# EAGLE design SSK_2014_V11 (EAGLE 5.12)
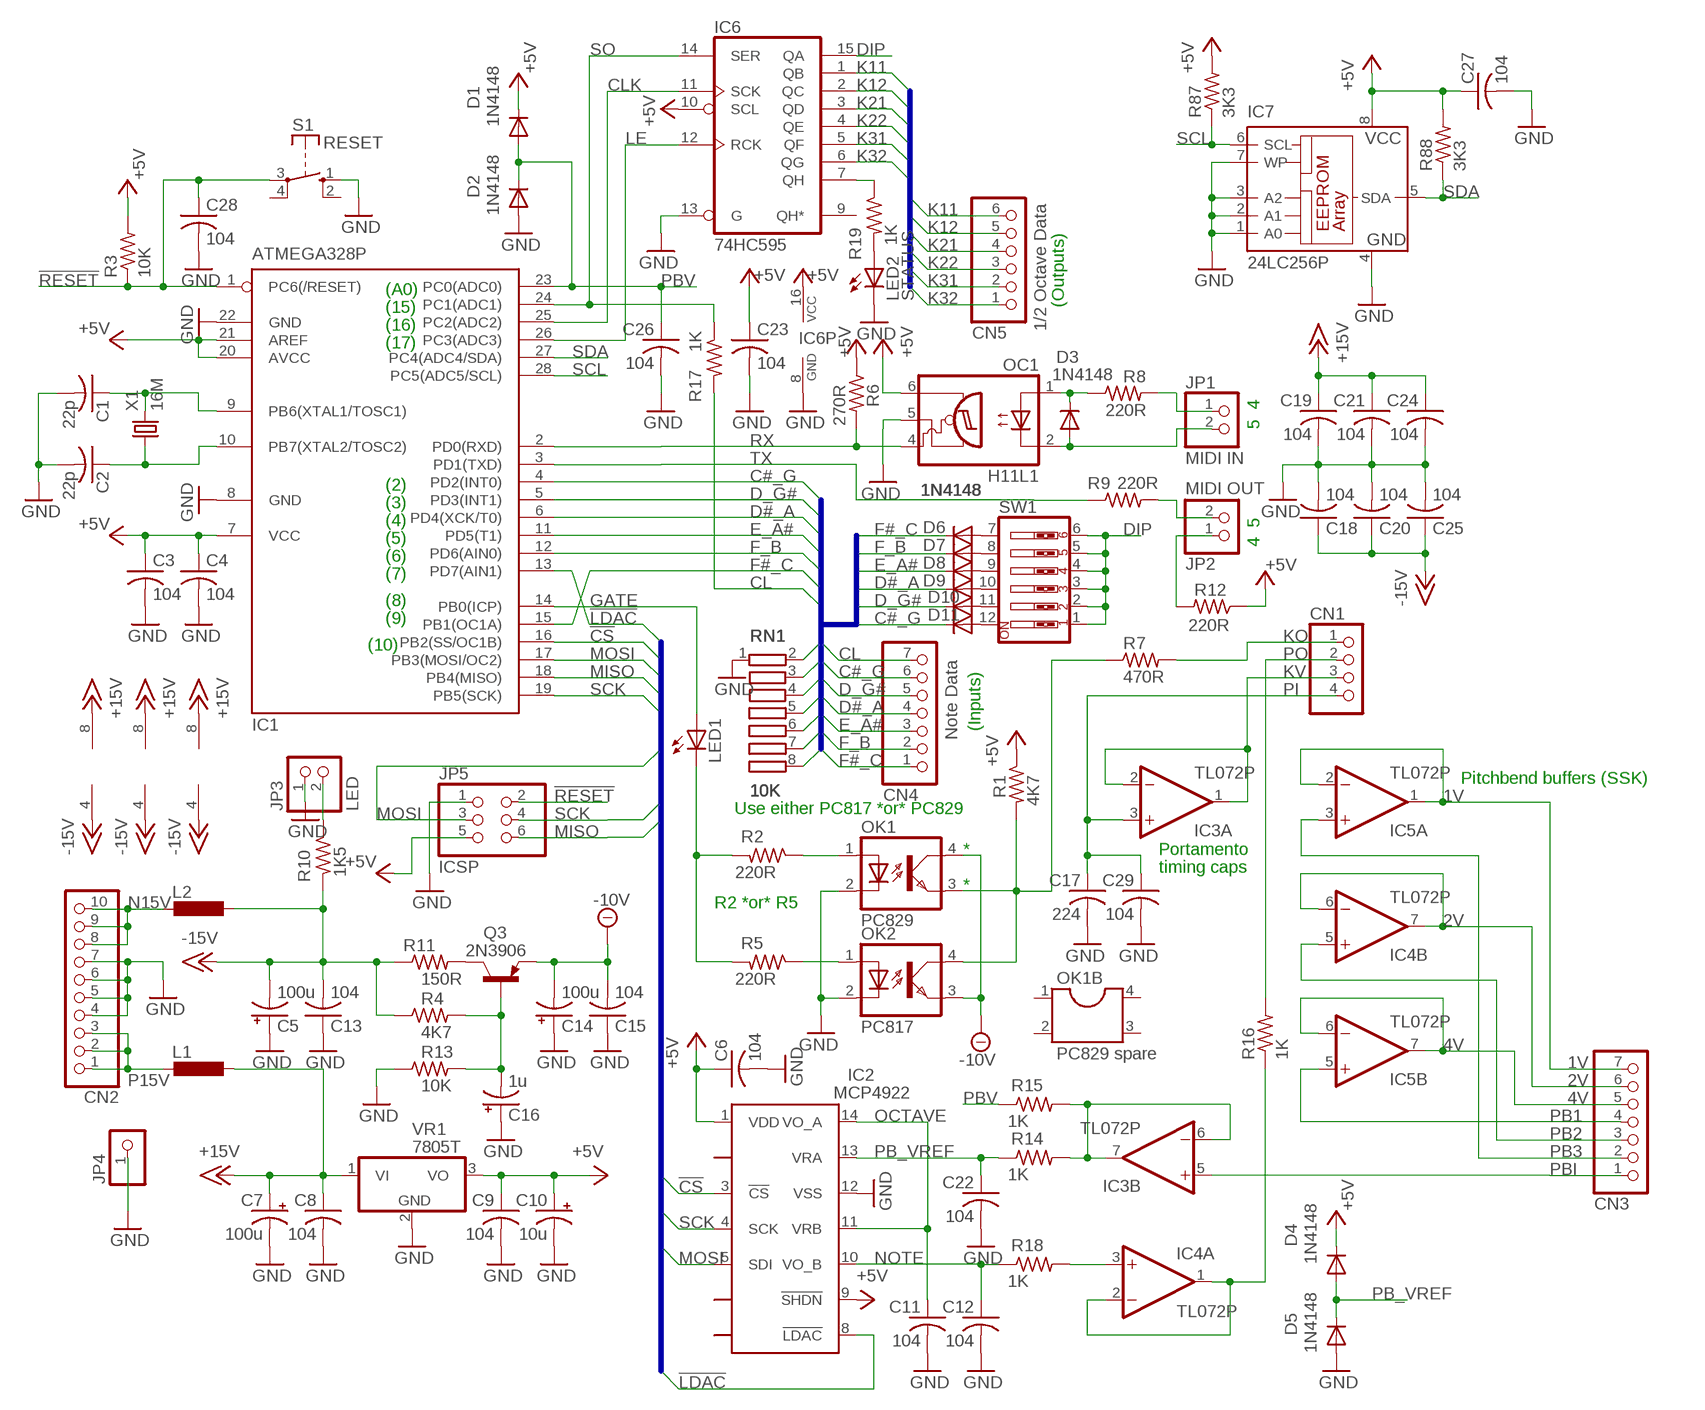
[diagram p0: schematic, sheet 1]

## Parts
C1  22p  C-USC0805K  [C0805K]
C2  22p  C-USC0805K  [C0805K]
C3  104  C-USC0805K  [C0805K]
C4  104  C-USC0805K  [C0805K]
C5  100u  CPOL-USE2.5-7  [E2,5-7]
C6  104  C-USC0805K  [C0805K]
C7  100u  CPOL-USE2.5-7  [E2,5-7]
C8  104  C-USC0805K  [C0805K]
C9  104  C-USC0805K  [C0805K]
C10  10u  CPOL-USE2.5-7  [E2,5-7]
C11  104  C-USC0805K  [C0805K]
C12  104  C-USC0805K  [C0805K]
C13  104  C-USC0805K  [C0805K]
C14  100u  CPOL-USE2.5-7  [E2,5-7]
C15  104  C-USC0805K  [C0805K]
C16  1u  CPOL-USE2.5-7  [E2,5-7]
C17  224  C-US050-030X075  [C050-030X075]
C18  104  C-USC0805K  [C0805K]
C19  104  C-USC0805K  [C0805K]
C20  104  C-USC0805K  [C0805K]
C21  104  C-USC0805K  [C0805K]
C22  104  C-USC0805K  [C0805K]
C23  104  C-USC0805K  [C0805K]
C24  104  C-USC0805K  [C0805K]
C25  104  C-USC0805K  [C0805K]
C26  104  C-USC0805K  [C0805K]
C27  104  C-USC0805K  [C0805K]
C28  104  C-USC0805K  [C0805K]
C29  104  C-US050-030X075  [C050-030X075]
CN1  PINHD-1X4  [1X04]
CN2  PINHD-1X10  [1X10]
CN3  PINHD-1X7  [1X07]
CN4  Note Data  PINHD-1X7  [1X07]
CN5  1/2 Octave Data  PINHD-1X6  [1X06]
D1  1N4148  DIODE-D-5  [D-5]
D2  1N4148  DIODE-D-5  [D-5]
D3  1N4148  1N4148DO35-7  [DO35-7]
D4  1N4148  DIODE-D-5  [D-5]
D5  1N4148  DIODE-D-5  [D-5]
D6  1N4148  DIODE-D-5  [D-5]
D7  1N4148  DIODE-D-5  [D-5]
D8  1N4148  DIODE-D-5  [D-5]
D9  1N4148  DIODE-D-5  [D-5]
D10  1N4148  DIODE-D-5  [D-5]
D11  1N4148  DIODE-D-5  [D-5]
IC1  ATMEGA328P  MEGA8-PN  [DIL28-3N]
IC2  MCP4922  MCP4922N  [DIL14N]
IC3  TL072P  [DIL08]
IC4  TL072P  [DIL08]
IC5  TL072P  [DIL08]
IC6  74HC595  [DIL16N]
IC7  24LC256P  [DIL8]
JP1  MIDI IN  PINHD-1X2  [1X02]
JP2  MIDI OUT  PINHD-1X2  [1X02]
JP3  LED  PINHD-1X2  [1X02]
JP4  PINHD-1X1  [1X01]
JP5  ICSP  PINHD-2X3  [2X03]
L1  L-EU0207/10  [0207/10]
L2  L-EU0207/10  [0207/10]
LED1  LED3MM  [LED3MM]
LED2  STATUS  LED3MM  [LED3MM]
OC1  H11L1  H11L1-M  [DIL06]
OK1  PC829  PC817  [DIL04]
OK1B  PC829 spare  DIL4  [DIL04]
OK2  PC817  [DIL04]
Q3  2N3906  [TO92]
R1  4K7  R-US_0207/10  [0207/10]
R2  220R  R-US_0207/10  [0207/10]
R3  10K  R-US_0207/10  [0207/10]
R4  4K7  R-US_0207/10  [0207/10]
R5  220R  R-US_0207/10  [0207/10]
R6  270R  R-US_0207/10  [0207/10]
R7  470R  R-US_0207/10  [0207/10]
R8  220R  R-US_0207/10  [0207/10]
R9  220R  R-US_0207/10  [0207/10]
R10  1K5  R-US_0207/10  [0207/10]
R11  150R  R-US_0207/10  [0207/10]
R12  220R  R-US_0207/10  [0207/10]
R13  10K  R-US_0207/10  [0207/10]
R14  1K  R-US_0207/10  [0207/10]
R15  1K  R-US_0207/10  [0207/10]
R16  1K  R-US_0207/10  [0207/10]
R17  1K  R-US_0207/10  [0207/10]
R18  1K  R-US_0207/10  [0207/10]
R19  1K  R-US_0207/10  [0207/10]
R87  3K3  R-US_0207/10  [0207/10]
R88  3K3  R-US_0207/10  [0207/10]
RN1  10K  GE07RP  [SIL8]
S1  RESET  RACON12  [RACON12]
SW1  SW_DIP-6  [EDG-06]
VR1  7805T  [TO220H]
X1  16M  CRYSTALHC49S  [HC49/S]

## Nets
1V: CN3.7 IC5.1(A:OUT) IC5.2(A:-IN)
2V: CN3.6 IC4.6(B:-IN) IC4.7(B:OUT)
4V: CN3.5 IC5.6(B:-IN) IC5.7(B:OUT)
!CS!: IC1.16(PB2(SS/OC1B)) IC2.3(!CS)
!LDAC!: IC1.13(PD7(AIN1)) IC2.8(!LDAC)
!RESET: C28.1 IC1.1(PC6(/RESET)) JP5.2 R3.1 S1.3(P)
+5V: C3.1 C4.1 C6.1 C9.1 C10.+ C23.1 C27.1 D1.C D4.C IC1.7(VCC) IC1.20(AVCC) IC1.21(AREF) IC2.1(VDD) IC2.9(!SHDN!) IC6.10(SCL) IC6.16(VCC) IC7.8(VCC) JP5.5 OC1.6(VCC) R1.1 R3.2 R6.1 R12.1 R87.2 R88.2 VR1.3(VO)
+15V: C7.+ C8.1 C19.1 C21.1 C24.1 IC3.8(P:V+) IC4.8(P:V+) IC5.8(P:V+) L1.1 VR1.1(VI)
-10V: C14.- C15.2 OK1.4(COL) OK2.3(EMIT) Q3.3(E)
-15V: C5.- C13.2 C18.1 C20.1 C25.1 IC3.4(P:V-) IC4.4(P:V-) IC5.4(P:V-) L2.1 R4.1 R10.2 R11.1
C#_G: CN4.6 D11.C IC1.4(PD2(INT0)) RN1.3
CL: CN4.7 R17.2 RN1.2
CLK: IC1.25(PC2(ADC2)) IC6.11(SCK)
D#_A: CN4.4 D9.C IC1.6(PD4(XCK/T0)) RN1.5
D_G#: CN4.5 D10.C IC1.5(PD3(INT1)) RN1.4
DBG: IC6.7(QH) R19.1
DIP: IC6.15(QA) SW1.1 SW1.2 SW1.3 SW1.4 SW1.5 SW1.6
E_A#: CN4.3 D8.C IC1.11(PD5(T1)) RN1.6
F#_C: CN4.1 D6.C IC1.15(PB1(OC1A)) RN1.8
F_B: CN4.2 D7.C IC1.12(PD6(AIN0)) RN1.7
GATE: IC1.14(PB0(ICP)) LED1.A
GND: C1.2 C2.2 C3.2 C4.2 C5.+ C6.2 C7.- C8.2 C9.2 C10.- C11.2 C12.2 C13.1 C14.+ C15.1 C16.+ C17.2 C18.2 C19.2 C20.2 C21.2 C22.2 C23.2 C24.2 C25.2 C26.2 C27.2 C28.2 C29.2 CN2.4 CN2.5 CN2.6 CN2.7 D2.A D5.A IC1.8(GND) IC1.22(GND) IC2.12(VSS) IC6.8(GND) IC6.13(G) IC7.1(A0) IC7.2(A1) IC7.3(A2) IC7.4(GND) IC7.7(WP) JP3.1 JP4.1 JP5.1 LED2.K(C) OC1.5(GND) OK1.2(C) OK2.2(C) R13.1 RN1.1 S1.1(S) VR1.2(GND)
K11: CN5.6 IC6.1(QB)
K12: CN5.5 IC6.2(QC)
K21: CN5.4 IC6.3(QD)
K22: CN5.3 IC6.4(QE)
K31: CN5.2 IC6.5(QF)
K32: CN5.1 IC6.6(QG)
KO: CN1.1 R7.2
KV: CN1.3 IC3.1(A:OUT) IC3.2(A:-IN)
LE: IC1.26(PC3(ADC3)) IC6.12(RCK)
MISO: IC1.18(PB4(MISO)) JP5.6
MOSI: IC1.17(PB3(MOSI/OC2)) IC2.5(SDI) JP5.3
N15V: CN2.8 CN2.9 CN2.10 L2.2
N$1: D6.A SW1.7
N$2: IC4.3(A:+IN) R18.2
N$3: IC3.6(B:-IN) IC3.7(B:OUT) R14.2 R15.2
N$4: D7.A SW1.8
N$5: OK1.1(A) R2.1
N$6: D8.A SW1.9
N$7: LED1.K(C) R2.2 R5.2
N$8: LED2.A R19.2
N$9: D3.C OC1.1(A) R8.1
N$10: OK2.1(A) R5.1
N$11: C16.- Q3.2(B) R4.2 R13.2
N$12: OK1.3(EMIT) OK2.4(COL) R1.2 R7.1
N$13: Q3.1(C) R11.2
N$15: JP3.2 R10.1
N$17: D9.A SW1.10
N$18: D10.A SW1.11
N$19: D3.A JP1.2 OC1.2(C)
N$20: JP1.1 R8.2
N$21: IC4.1(A:OUT) IC4.2(A:-IN) R16.1
N$22: D11.A SW1.12
N$23: JP2.1 R12.2
N$24: JP2.2 R9.2
N$62: C1.1 IC1.9(PB6(XTAL1/TOSC1)) X1.2
N$63: C2.1 IC1.10(PB7(XTAL2/TOSC2)) X1.1
NOTE: C12.1 IC2.10(VO_B) R18.1
OCTAVE: C11.1 IC2.11(VRB) IC2.14(VO_A)
P15V: CN2.1 CN2.2 CN2.3 L1.2
PB1: CN3.4 IC5.5(B:+IN)
PB2: CN3.3 IC4.5(B:+IN)
PB3: CN3.2 IC5.3(A:+IN)
PB_VREF: C22.1 D4.A D5.C IC2.13(VRA) R14.1
PBI: CN3.1 IC3.5(B:+IN)
PBV: C26.1 D1.A D2.C IC1.23(PC0(ADC0)) R15.1
PI: C17.1 C29.1 CN1.4 IC3.3(A:+IN)
PO: CN1.2 R16.2
RX: IC1.2(PD0(RXD)) OC1.4(VO) R6.2
SCK: IC1.19(PB5(SCK)) IC2.4(SCK) JP5.4
SCL: IC1.28(PC5(ADC5/SCL)) IC7.6(SCL) R87.1
SDA: IC1.27(PC4(ADC4/SDA)) IC7.5(SDA) R88.1
SO: IC1.24(PC1(ADC1)) IC6.14(SER) R17.1
TX: IC1.3(PD1(TXD)) R9.1
Unconnected: IC6.9(QH*) OK1B.1 OK1B.2 OK1B.3 OK1B.4 S1.2(S) S1.4(P)

## Buses
!CS!,!LDAC!,MOSI,MISO,SCK
F#_C,F_B,E_A#,D#_A,D_G#,C#_G,CL
K11,K12,K21,K22,K31,K32

## Notes on the sheet
- (Outputs)
- (A0)
- (15)
- (16)
- (17)
- 5  4
- (2)
- (3)
- 4  5
- (4)
- (5)
- (6)
- (7)
- (8)
- (9)
- (10)
- (Inputs)
- Pitchbend buffers (SSK)
- Use either PC817 *or* PC829
- * | Portamento
- timing caps
- *
- R2 *or* R5

## Library data of the parts
C1-C4 C6 C8 C9 C11-C13 C15 C17-C29 = rcl:C-US: CAPACITOR, American symbol
C5 C7 C10 C14 C16 = rcl:CPOL-US: POLARIZED CAPACITOR, American symbol
CN1 = pinhead:PINHD-1X4: PIN HEADER
CN2 = pinhead:PINHD-1X10: PIN HEADER
CN3 CN4 = pinhead:PINHD-1X7: PIN HEADER
CN5 = pinhead:PINHD-1X6: PIN HEADER
D1 D2 D4-D11 = diode:DIODE-: DIODE
D3 = diode:1N4148: DIODE high speed (Philips)
IC1 = atmel:MEGA8-P: MICROCONTROLLER 8 Kbytes FLASH, 1 kbytes SRAM, 512 bytes EEPROM, USART, 4-channel 10 bit ADC, 2-channel 8 bit ADC Pin compatible with Atmega48, ATMega88, ATMega168 Source: avr.lbr
IC2 = s2m:MCP4922
IC3-IC5 = linear:TL072: OP AMP
IC6 = 74xx-eu:74*595: 8-bit SHIFT REGISTER, output latch
IC7 = microchip:24*: Serial EEPROM I2C; MF: MICROCHIP; MPN: 24LC256-E/P; OC_FARNELL: 9757970; OC_NEWARK: 92C7169
JP1-JP3 = pinhead:PINHD-1X2: PIN HEADER
JP4 = pinhead:PINHD-1X1: PIN HEADER
JP5 = pinhead:PINHD-2X3: PIN HEADER
L1 L2 = resistor:L-EU: INDUCTOR, European symbol
LED1 LED2 = led:LED: LED OSRAM: - CHIPLED LG R971, LG N971, LY N971, LG Q971, LY Q971, LO R971, LY R971 LH N974, LH R974 LS Q976, LO Q976, LY Q976 LO Q996 - Hyper CHIPLED LW Q18S LB Q993, LB Q99A, LB R99A - SideLED LS A670, LO A670, LY A670, LG A670, LP A670 LB A673, LV A673, LT A673, LW A673 LH A674 LY A675 LS A676, LA A676, LO A676, LY A676, LW A676 LS A679, LY A679, LG A679 - Hyper Micro SIDELED® LS Y876, LA Y876, LO Y876, LY Y876 LT Y87S - SmartLED LW L88C, LW L88S LB L89C, LB L89S, LG L890 LS L89K, LO L89K, LY L89K LS L896, LA L896, LO L896, LY L896 - TOPLED LS T670, LO T670, LY T670, LG T670, LP T670 LSG T670, LSP T670, LSY T670, LOP T670, LYG T670 LG T671, LOG T671, LSG T671 LB T673, LV T673, LT T673, LW T673 LH T674 LS T676, LA T676, LO T676, LY T676, LB T676, LH T676, LSB T676, LW T676 LB T67C, LV T67C, LT T67C, LS T67K, LO T67K, LY T67K, LW E67C LS E67B, LA E67B, LO E67B, LY E67B, LB E67C, LV E67C, LT E67C LW T67C LS T679, LY T679, LG T679 LS T770, LO T770, LY T770, LG T770, LP T770 LB T773, LV T773, LT T773, LW T773 LH T774 LS E675, LA E675, LY E675, LS T675 LS T776, LA T776, LO T776, LY T776, LB T776 LHGB T686 LT T68C, LB T68C - Hyper Mini TOPLED® LB M676 - Mini TOPLED Santana® LG M470 LS M47K, LO M47K, LY M47K Source: http://www.osram.convergy.de LUXEON: - LUMILED® LXK2-PW12-R00, LXK2-PW12-S00, LXK2-PW14-U00, LXK2-PW14-V00 LXK2-PM12-R00, LXK2-PM12-S00, LXK2-PM14-U00 LXK2-PE12-Q00, LXK2-PE12-R00, LXK2-PE12-S00, LXK2-PE14-T00, LXK2-PE14-U00 LXK2-PB12-K00, LXK2-PB12-L00, LXK2-PB12-M00, LXK2-PB14-N00, LXK2-PB14-P00, LXK2-PB14-Q00 LXK2-PR12-L00, LXK2-PR12-M00, LXK2-PR14-Q00, LXK2-PR14-R00 LXK2-PD12-Q00, LXK2-PD12-R00, LXK2-PD12-S00 LXK2-PH12-R00, LXK2-PH12-S00 LXK2-PL12-P00, LXK2-PL12-Q00, LXK2-PL12-R00 Source: www.luxeon.com KINGBRIGHT: KA-3528ASYC Source: www.kingbright.com
OC1 = s2m:H11L1-M
OK1 OK2 = optocoupler:PC817: SHARP OPTO COUPLER; MPN: PC817X4J000F; OC_FARNELL: 9707727; OC_NEWARK: 97K7059
OK1B = ic-package:DIL4: Dual In Line / Socket
Q3 = transistor-pnp:2N3906: PNP Transistor
R1-R19 R87 R88 = rcl:R-US_: RESISTOR, American symbol
RN1 = resistor-sil:GE07RP: SIL RESISTOR; OC_FARNELL: unknown; OC_NEWARK: unknown
S1 = switch-misc:RACON12: ITT SWITCH
SW1 = special:SW_DIP-6: DIP SWITCH
VR1 = linear:78*: Positive VOLTAGE REGULATOR Source: http://cache.national.com/ds/LM/LM78L05.pdf http://www.fairchildsemi.com/ds/LM/LM7805.pdf
X1 = crystal:CRYSTAL: CRYSTAL; OC_FARNELL: 1667008; OC_NEWARK: unknown

## Board
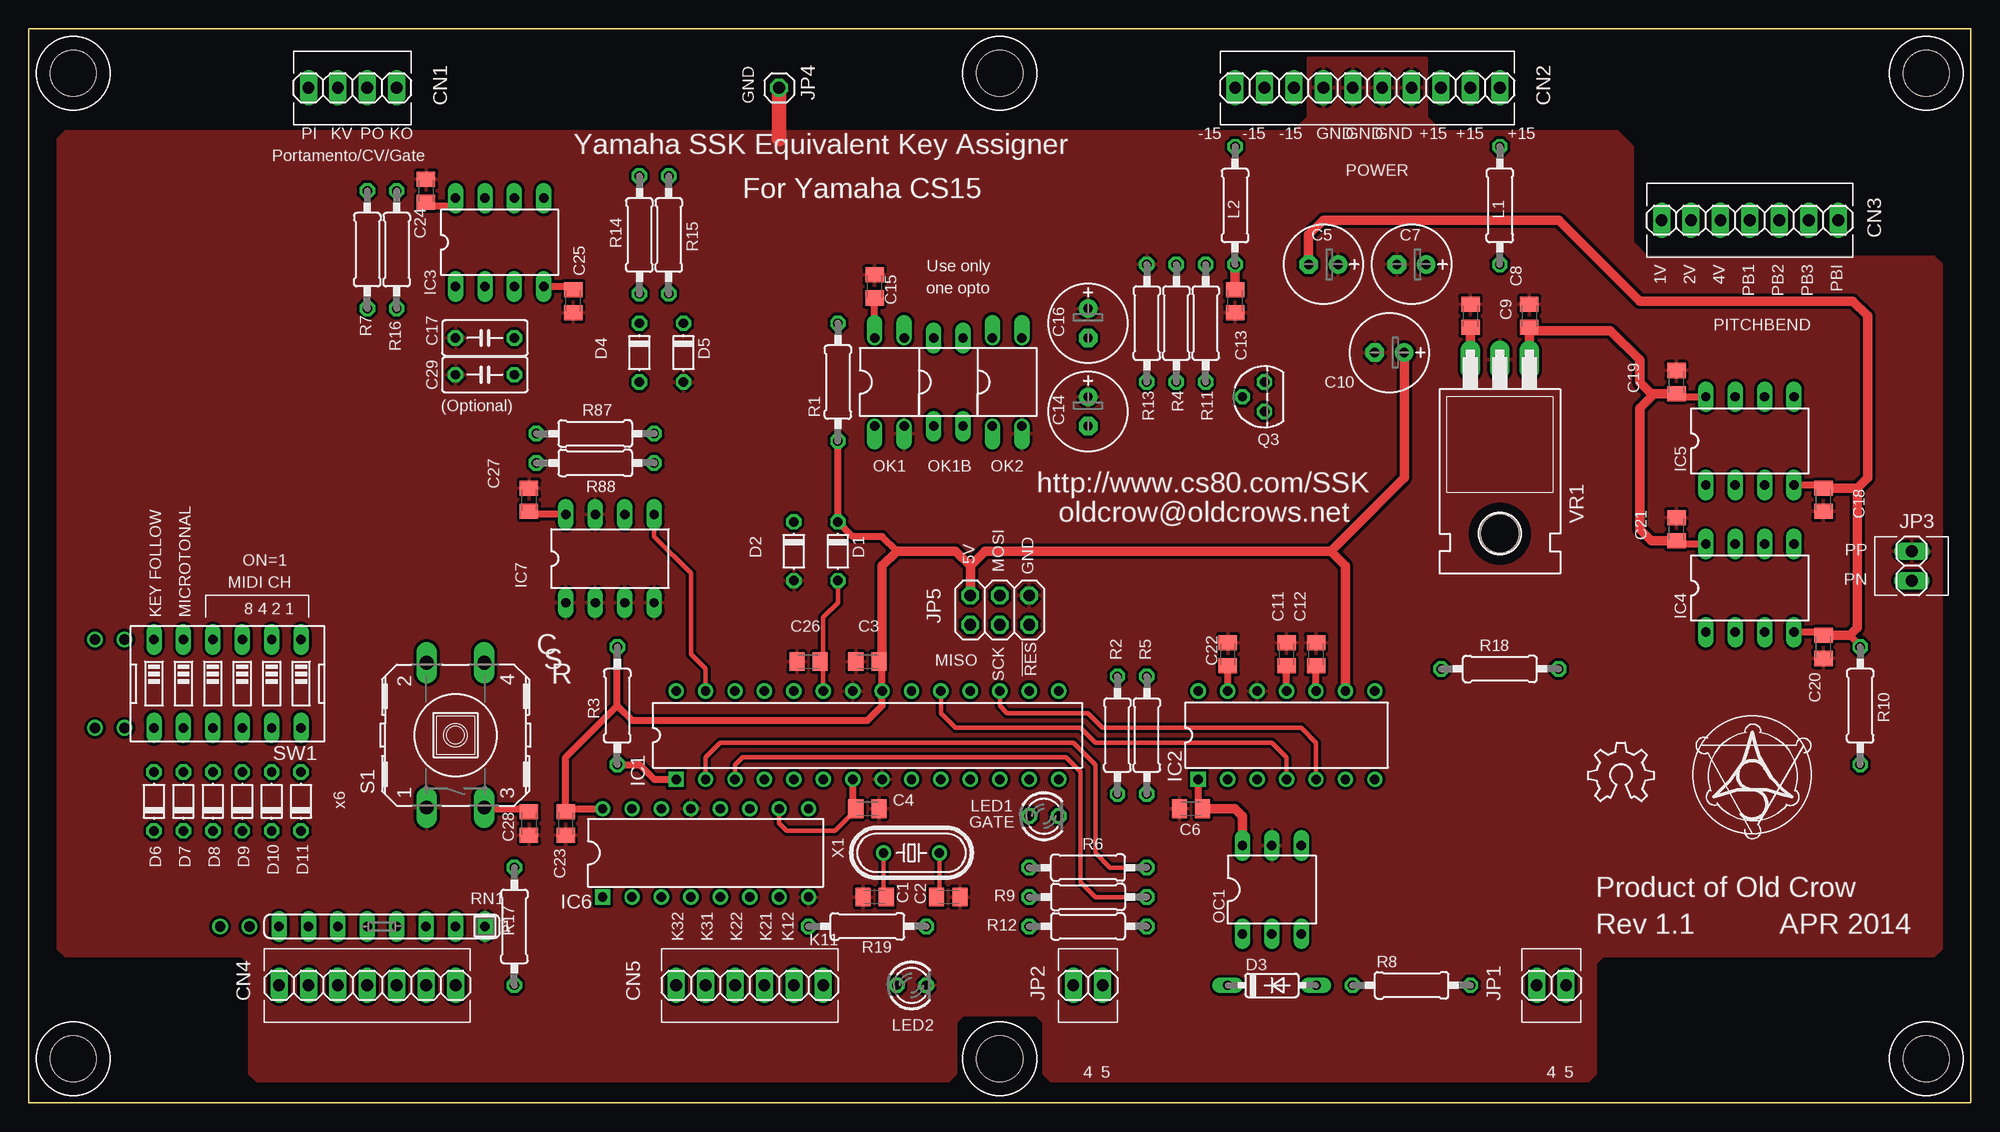
[diagram p1: board, top side]
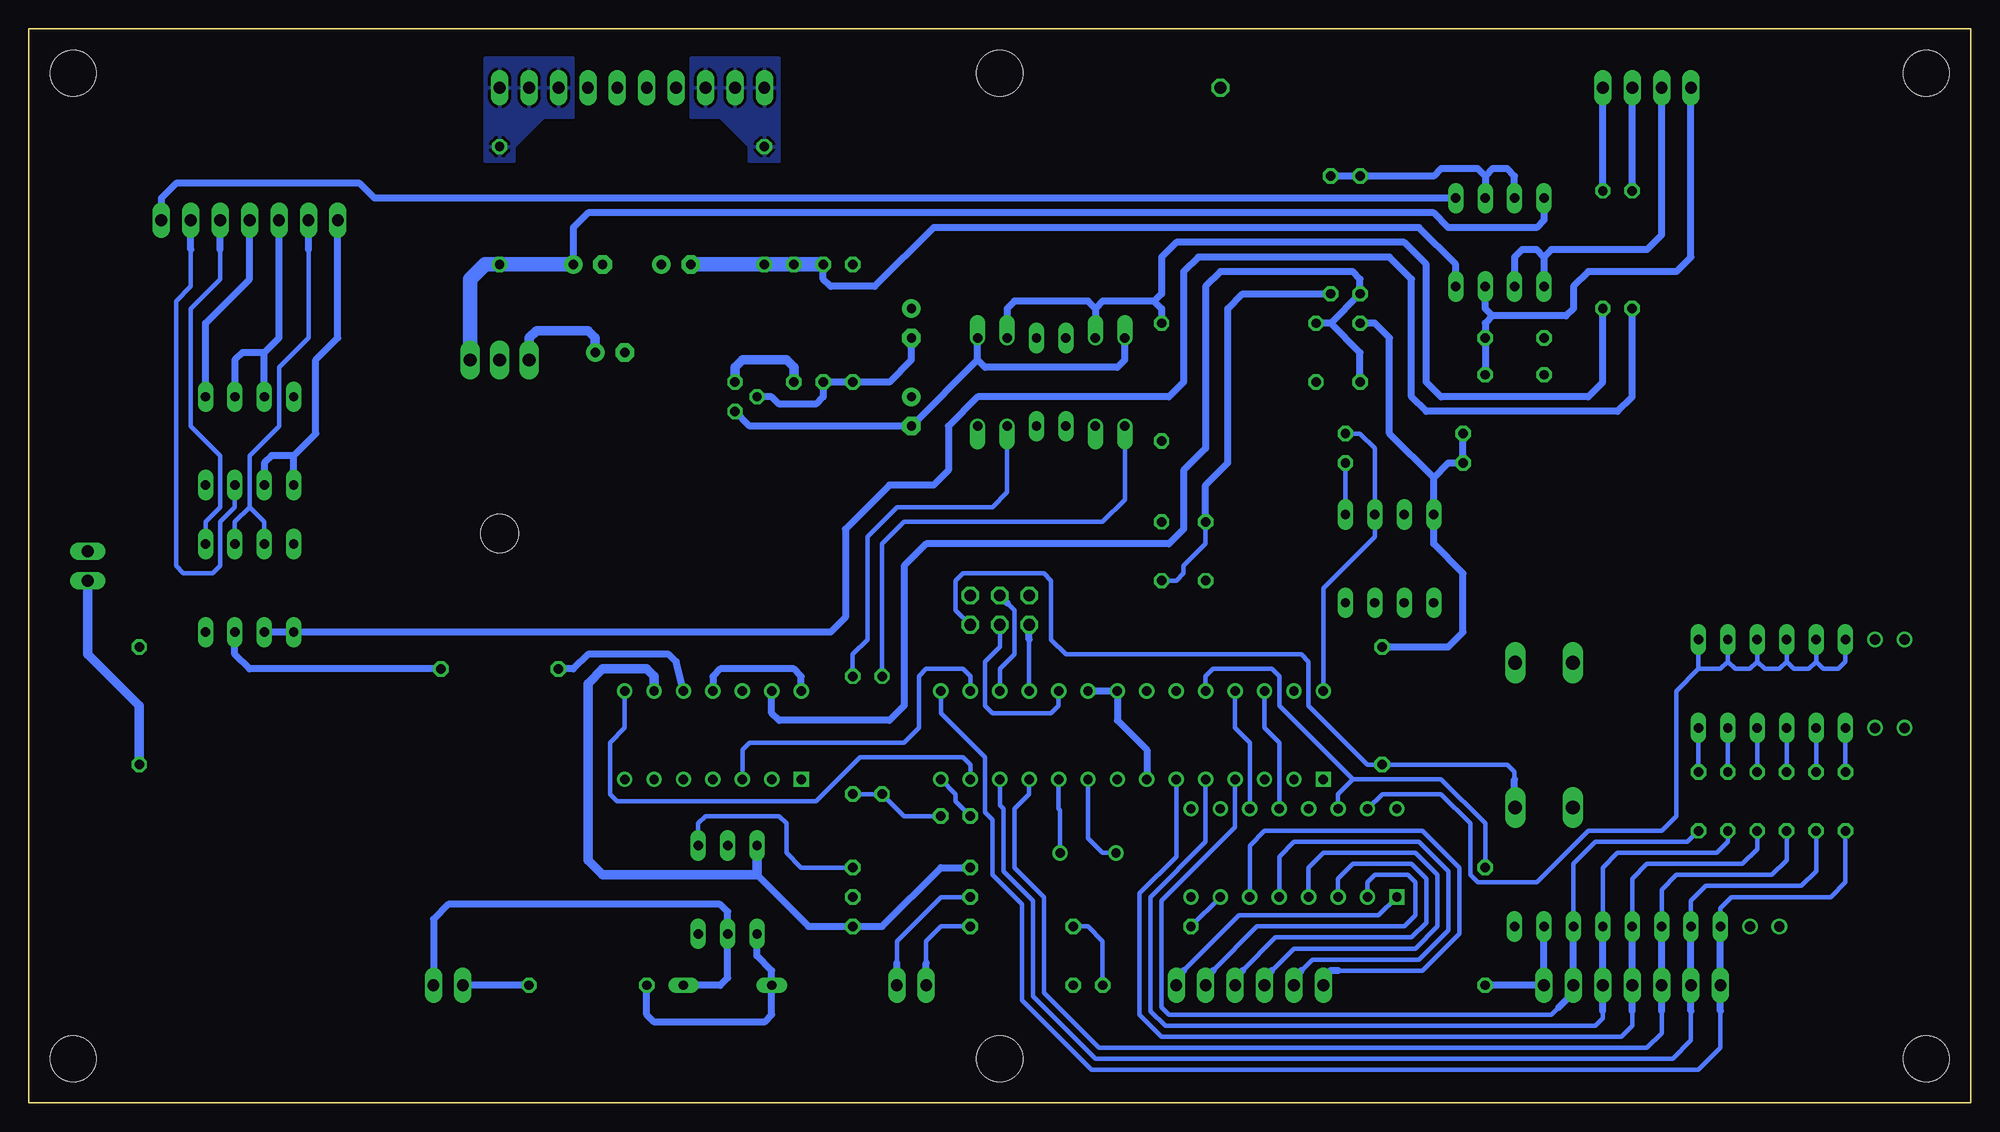
[diagram p2: board, bottom side, seen from below]

Size 167.64 x 92.71 mm. Coordinates in mm from the lower left corner, seen from the top.
Outline: 0,0 167.64,0 167.64,92.71 0,92.71 0,0
Copper layers (1*16): Top 0.035mm / dielectric 1.5mm / Bottom 0.035mm
Design rules "default *": minimum track width 10mil, minimum drill 24mil, track to track 8mil, track to pad 8mil, pad to pad 8mil, via to via 8mil, smd to smd 8mil, copper to edge 40mil, drill to drill 8mil, minimum pad ring 10mil, minimum via ring 8mil, stop-mask expansion 4mil, vias tented up to drill 0mil, thermal gap 10mil
Holes 3.96 mm at 3.81,3.81 3.81,88.9 163.83,3.81 163.83,88.9 83.82,88.9 83.82,3.81
Milling: 4 lines

### Footprints (pad centres in the part's own frame; a part is rotated, then mirrored left to right if it is on the bottom)
C0805K = smd 1.3 x 1.6: 1 -1,0; 2 1,0
E2,5-7 = drill 0.813 pad 1.6 round: + -1.27,0 | drill 0.813 pad 1.6 octagon: - 1.27,0
C050-030X075 = drill 0.813 octagon: 1 -2.54,0; 2 2.54,0
1X04 = drill 1.016 long: 1 -3.81,0; 2 -1.27,0; 3 1.27,0; 4 3.81,0
1X10 = drill 1.016 long: 1 -11.43,0; 2 -8.89,0; 3 -6.35,0; 4 -3.81,0; 5 -1.27,0; 6 1.27,0; 7 3.81,0; 8 6.35,0; 9 8.89,0; 10 11.43,0
1X07 = drill 1.016 long: 1 -7.62,0; 2 -5.08,0; 3 -2.54,0; 4 0,0; 5 2.54,0; 6 5.08,0; 7 7.62,0
1X06 = drill 1.016 long: 1 -6.35,0; 2 -3.81,0; 3 -1.27,0; 4 1.27,0; 5 3.81,0; 6 6.35,0
D-5 = drill 0.813 octagon: A 2.54,0; C -2.54,0
DO35-7 = drill 0.813 long: A 3.81,0; C -3.81,0
DIL28-3N = drill 0.813 square: 1 -16.51,-3.81 | drill 0.813 round: 2 -13.97,-3.81; 3 -11.43,-3.81; 4 -8.89,-3.81; 5 -6.35,-3.81; 6 -3.81,-3.81; 7 -1.27,-3.81; 8 1.27,-3.81; 9 3.81,-3.81; 10 6.35,-3.81; 11 8.89,-3.81; 12 11.43,-3.81; 13 13.97,-3.81; 14 16.51,-3.81; 15 16.51,3.81; 16 13.97,3.81; 17 11.43,3.81; 18 8.89,3.81; 19 6.35,3.81; 20 3.81,3.81; 21 1.27,3.81; 22 -1.27,3.81; 23 -3.81,3.81; 24 -6.35,3.81; 25 -8.89,3.81; 26 -11.43,3.81; 27 -13.97,3.81; 28 -16.51,3.81
DIL14N = drill 0.813 square: 1 -7.62,-3.81 | drill 0.813 round: 2 -5.08,-3.81; 3 -2.54,-3.81; 4 0,-3.81; 5 2.54,-3.81; 6 5.08,-3.81; 7 7.62,-3.81; 8 7.62,3.81; 9 5.08,3.81; 10 2.54,3.81; 11 0,3.81; 12 -2.54,3.81; 13 -5.08,3.81; 14 -7.62,3.81
DIL08 = drill 0.813 long: 1 -3.81,-3.81; 2 -1.27,-3.81; 3 1.27,-3.81; 4 3.81,-3.81; 5 3.81,3.81; 6 1.27,3.81; 7 -1.27,3.81; 8 -3.81,3.81
DIL16N = drill 0.813 square: 1 -8.89,-3.81 | drill 0.813 round: 2 -6.35,-3.81; 3 -3.81,-3.81; 4 -1.27,-3.81; 5 1.27,-3.81; 6 3.81,-3.81; 7 6.35,-3.81; 8 8.89,-3.81; 9 8.89,3.81; 10 6.35,3.81; 11 3.81,3.81; 12 1.27,3.81; 13 -1.27,3.81; 14 -3.81,3.81; 15 -6.35,3.81; 16 -8.89,3.81
DIL8 = drill 0.813 long: 1 -3.81,-3.81; 2 -1.27,-3.81; 3 1.27,-3.81; 4 3.81,-3.81; 5 3.81,3.81; 6 1.27,3.81; 7 -1.27,3.81; 8 -3.81,3.81
1X02 = drill 1.016 long: 1 -1.27,0; 2 1.27,0
1X01 = drill 1.016 octagon: 1 0,0
2X03 = drill 1.016 octagon: 1 -2.54,-1.27; 2 -2.54,1.27; 3 0,-1.27; 4 0,1.27; 5 2.54,-1.27; 6 2.54,1.27
0207/10 = drill 0.813 octagon: 1 -5.08,0; 2 5.08,0
LED3MM = drill 0.813 octagon: A -1.27,0; K 1.27,0
DIL06 = drill 0.813 long: 1 -2.54,-3.81; 2 0,-3.81; 3 2.54,-3.81; 4 2.54,3.81; 5 0,3.81; 6 -2.54,3.81
DIL04 = drill 0.813 offset: 1 -1.27,-3.81; 2 1.27,-3.81; 3 1.27,3.81; 4 -1.27,3.81
DIL04' = drill 0.813 long: 1 -1.27,-3.81; 2 1.27,-3.81; 3 1.27,3.81; 4 -1.27,3.81
TO92 = drill 0.813 octagon: 1 1.27,0; 2 0,1.905; 3 -1.27,0
SIL8 = drill 0.813 long: 1 -8.89,0; 2 -6.35,0; 3 -3.81,0; 4 -1.27,0; 5 1.27,0; 6 3.81,0; 7 6.35,0; 8 8.89,0
RACON12 = drill 1.194 long: 1 -6.248,2.489; 2 6.248,2.489; 3 -6.248,-2.489; 4 6.248,-2.489
EDG-06 = drill 0.813 long: 1 -6.35,-3.81; 2 -3.81,-3.81; 3 -1.27,-3.81; 4 1.27,-3.81; 5 3.81,-3.81; 6 6.35,-3.81; 7 6.35,3.81; 8 3.81,3.81; 9 1.27,3.81; 10 -1.27,3.81; 11 -3.81,3.81; 12 -6.35,3.81
TO220H = drill 1.118 long: 1 -2.54,-10.16; 2 0,-10.16; 3 2.54,-10.16 | hole 3.302: 0,4.826
HC49/S = drill 0.813 round: 1 -2.413,0; 2 2.413,0

### Placement (x,y rotation side)
C1  73.03,17.78 180 top
C2  79.38,17.78 0 top
C3  72.39,38.1 180 top
C4  72.39,25.4 0 top
C5  111.76,72.39 180 top
C6  100.33,25.4 180 top
C7  119.38,72.39 180 top
C8  129.54,67.94 90 top
C9  124.46,67.94 90 top
C10  117.47,64.77 180 top
C11  108.58,38.73 90 top
C12  111.12,38.73 90 top
C13  104.14,69.22 90 top
C14  91.44,59.69 270 top
C15  73.03,70.48 270 top
C16  91.44,67.31 270 top
C17  39.37,66.04 180 top
C18  154.94,52.07 270 top
C19  142.24,62.23 90 top
C20  154.94,39.37 270 top
C21  142.24,49.53 90 top
C22  103.5,38.73 90 top
C23  46.35,24.13 270 top
C24  34.29,78.74 90 top
C25  46.99,69.22 270 top
C26  67.31,38.1 180 top
C27  43.18,52.07 90 top
C28  43.18,24.13 270 top
C29  39.37,62.87 180 top
CN1  27.94,87.63 180 top
CN2  115.57,87.63 180 top
CN3  148.59,76.2 180 top
CN4  29.21,10.16 0 top
CN5  62.23,10.16 0 top
D1  69.85,47.62 270 top
D2  66.04,47.62 270 top
D3  107.31,10.16 0 top
D4  52.7,64.77 270 top
D5  56.52,64.77 270 top
D6  10.79,26.04 90 top
D7  13.34,26.04 90 top
D8  15.88,26.04 90 top
D9  18.41,26.04 90 top
D10  20.95,26.04 90 top
D11  23.5,26.04 90 top
IC1  72.39,31.75 0 top
IC2  108.58,31.75 0 top
IC3  40.64,74.3 0 top
IC4  148.59,44.45 0 top
IC5  148.59,57.15 0 top
IC6  58.42,21.59 0 top
IC7  50.16,46.99 0 top
JP1  131.44,10.16 0 top
JP2  91.44,10.16 0 top
JP3  162.56,46.35 270 top
JP4  64.77,87.63 0 top
JP5  83.82,42.55 180 top
L1  127,77.47 90 top
L2  104.14,77.47 90 top
LED1  87.63,24.77 0 top
LED2  76.2,10.16 0 top
OC1  107.31,18.41 0 top
OK1  74.3,62.23 0 top
OK1B  PC829 spare  [DIL04']  79.38,62.23 0 top
OK2  84.45,62.23 0 top
Q3  106.68,60.96 90 top
R1  69.85,62.23 90 top
R2  93.98,31.75 270 top
R3  50.8,34.29 90 top
R4  99.06,67.31 270 top
R5  96.52,31.75 270 top
R6  91.44,20.32 0 top
R7  31.75,73.66 90 top
R8  119.38,10.16 0 top
R9  91.44,17.78 180 top
R10  158.12,34.29 90 top
R11  101.6,67.31 270 top
R12  91.44,15.24 180 top
R13  96.52,67.31 270 top
R14  52.7,74.93 90 top
R15  55.24,74.93 90 top
R16  29.21,73.66 90 top
R17  41.91,15.24 270 top
R18  127,37.47 0 top
R19  72.39,15.24 0 top
R87  48.9,57.78 180 top
R88  48.9,55.24 180 top
RN1  30.48,15.24 180 top
S1  36.83,31.75 90 top
SW1  17.14,36.2 180 top
U$1  [OSHW_6X200_NOTEXT]  134.62,26.04 0 top
VR1  127,53.98 180 top
X1  76.2,21.59 180 top

### Tracks (layer width: path | path; a pad name or v marks a point on that pad's centre or on a via)
1V
  Bottom 0.61: CN3.7 140.97,66.04 142.88,64.14 142.88,57.78 144.78,55.88 | IC5.2 147.32,55.24 146.69,55.88 144.78,55.88 | IC5.1 144.78,55.88
2V
  Bottom 0.406: IC4.7 147.32,50.16 148.59,51.44 | 148.59,51.44 148.59,55.88 146.05,58.42 146.05,63.5 143.51,66.04 143.51,73.66 | IC4.6 149.86,50.16 148.59,51.44
  Bottom 0.61: 143.51,73.66 CN3.6
4V
  Bottom 0.61: IC5.6 149.86,64.14 149.22,64.77 147.32,64.77 | IC5.7 147.32,64.77 | 147.32,64.77 146.05,66.04 CN3.5
!CS!
  Bottom 0.406: IC2.3 106.05,30.48 105.41,31.11 92.08,31.11 90.81,32.38 90.81,36.83 90.17,37.47 87,37.47 86.36,36.83 IC1.16
!LDAC!
  Bottom 0.406: IC1.13 86.36,29.21 87,29.84 95.89,29.84 99.69,26.04 116.84,26.04 117.47,26.67 117.47,31.11 116.2,32.38 IC2.8
!RESET
  Top 0.61: R3.1 52.7,29.21 53.98,27.94 IC1.1 | C28.1 42.81,25.13 42.55,25.4 39.42,25.4 S1.3
  Bottom 0.406: JP5.2 87.63,42.55 87.63,45.09 87,45.72 80.01,45.72 79.38,45.09 79.38,40.01 78.11,38.73 57.78,38.73 57.15,38.1 57.15,34.29 52.07,29.21 R3.1 40.01,29.21 39.37,28.57 39.37,27.94
  Bottom 0.61: S1.3 39.32,26.62 39.37,26.67 39.37,27.94
+5V
  Top 0.406: C6.1 101.6,25.4 | IC6.10 64.77,24.13 65.41,23.5 69.6,23.5 71.12,25.02 71.12,25.4
  Top 0.61: C3.1 73.66,38.1 IC1.21 73.66,34.29 72.39,33.02 52.07,33.02 50.8,34.29 | 50.8,34.29 R3.2 | 74.93,47.62 73.66,48.9 71.12,48.9 D1.C R1.1 | C6.1 101.33,25.67 100.97,26.04 IC2.1 | C23.1 46.35,25.4 | 46.35,25.4 IC6.16 | 46.35,25.4 46.35,29.84 50.8,34.29 | C4.1 71.12,25.4 IC1.7 | C27.1 43.18,50.8 IC7.8
  Top 0.813: C6.1 104.14,25.4 104.78,24.77 OC1.6 | 73.66,38.1 73.66,46.35 74.93,47.62 80.01,47.62 81.28,46.35 | 81.28,46.35 82.55,47.62 112.39,47.62 | 112.39,47.62 113.67,46.35 IC2.9 | 112.39,47.62 118.75,53.98 C10.+ | 81.28,46.35 JP5.5 | VR1.3 C9.1
  Bottom 0.61: IC1.7 71.12,30.48 73.66,33.02 IC1.21 IC1.20 | R6.1 88.9,20.32 93.98,15.24 R12.1 100.33,15.24 104.78,19.68 | R87.2 R88.2 45.09,55.24 46.35,53.98 | 46.35,53.98 IC7.8 46.35,48.26 43.81,45.72 43.81,40.64 45.09,39.37 R3.2 | 46.35,53.98 50.16,57.78 50.16,66.04 51.44,67.31 D4.C
  Bottom 0.813: VR1.3 124.46,66.04 123.83,66.67 119.38,66.67 118.75,66.04 C10.+ | IC2.9 113.67,36.83 114.3,37.47 118.11,37.47 119.38,36.2 119.38,20.95 118.11,19.68 104.78,19.68 OC1.6
+15V
  Top 0.61: C19.1 142.24,60.96 IC5.8 | C21.1 142.24,48.26 IC4.8 | C24.1 34.29,77.47 36.83,77.47 IC3.8
  Top 0.813: 140.34,61.23 140.06,61.23 139.06,62.23 139.06,64.14 136.53,66.67 129.81,66.67 C8.1 VR1.1 129.54,64.77 | 140.34,61.23 C19.1 | C21.1 140.06,48.53 139.06,49.53 139.06,59.96 140.34,61.23
  Bottom 0.61: C7.+ 120.65,75.56 119.38,76.83 46.35,76.83 45.09,75.56 37.47,75.56 36.83,76.2 IC3.8
  Bottom 1.27: C7.+ L1.1 128.27,72.39 129.54,71.12 VR1.1
-10V
  Top 0.61: OK1.4 C15.2
  Bottom 0.61: Q3.3 105.41,58.42 C14.- 85.72,64.14 | 85.72,64.14 85.09,63.5 73.66,63.5 73.03,64.14 OK1.4 | 85.72,64.14 OK2.3
-15V
  Top 0.61: C18.1 154.94,53.34 IC5.4 | C20.1 154.31,40.64 IC4.4 | C25.1 46.99,70.48 IC3.4 | R10.2 158.12,39.47 157.21,40.37
  Top 0.813: 157.84,53.07 C18.1 | 157.84,53.07 158.75,53.98 158.75,55.24 158.75,67.94 157.48,69.22 139.06,69.22 132.08,76.2 111.76,76.2 110.49,74.93 C5.- | C20.1 157.21,40.37 157.84,41.01 157.84,53.07 | L2.1 C13.2
  Bottom 0.61: IC3.4 44.45,72.39 47.62,75.56 89.53,75.56 94.61,70.48 98.42,70.48 99.06,71.12 R4.1
  Bottom 1.27: C5.- L2.1 R11.1 R4.1
C#_G
  Bottom 0.406: 35.56,8.26 36.2,7.62 69.22,7.62 69.85,8.26 69.85,17.46 63.5,23.81 IC1.4 | RN1.3 34.29,20.64 32.38,22.54 24.45,22.54 D11.C
  Bottom 0.61: RN1.3 CN4.6 34.29,9.53 35.56,8.26
CL
  Bottom 0.61: RN1.2 CN4.7 R17.2
CLK
  Bottom 0.406: IC6.11 62.23,26.04 62.23,27.3 62.23,31.11 63.5,32.38 IC1.25
D#_A
  Bottom 0.406: 29.21,7.94 29.21,6.67 30.16,5.71 69.85,5.71 71.75,7.62 71.75,18.1 68.58,21.27 IC1.6 | RN1.5 29.21,19.37 27.94,20.64 19.68,20.64 18.41,21.91 D9.C
  Bottom 0.61: 29.21,7.94 CN4.4 RN1.5
D_G#
  Bottom 0.406: 31.75,7.94 31.75,7.3 32.38,6.67 69.53,6.67 70.8,7.94 70.8,17.78 66.04,22.54 IC1.5 | RN1.4 31.75,20.32 30.48,21.59 21.91,21.59 20.95,22.54 D10.C
  Bottom 0.61: 31.75,7.94 CN4.5 RN1.4
DBG
  Bottom 0.406: R19.1 IC6.7
DIP
  Bottom 0.406: IC6.15 50.8,26.67 45.72,26.67 43.18,24.13 43.18,19.68 42.55,19.05 37.47,19.05 33.02,23.5 26.67,23.5 25.4,24.77 25.4,35.56 23.5,37.47 | 23.5,37.47 21.59,37.47 20.95,38.1 | 20.95,38.1 20.32,37.47 19.05,37.47 18.41,38.1 | 18.41,38.1 17.78,37.47 16.51,37.47 15.88,38.1 | 15.88,38.1 15.24,37.47 13.97,37.47 13.34,38.1 | 13.34,38.1 12.7,37.47 11.43,37.47 10.79,38.1 SW1.6 | 13.34,38.1 SW1.5 | 15.88,38.1 SW1.4 | 18.41,38.1 SW1.3 | 20.95,38.1 SW1.2 | 23.5,37.47 SW1.1
E_A#
  Bottom 0.406: IC1.11 81.28,26.67 82.55,25.4 82.55,20.32 80.01,17.78 80.01,9.53 75.25,4.76 27.94,4.76 26.67,6.03 26.67,7.94 | RN1.6 26.67,18.41 25.4,19.68 17.14,19.68 15.88,20.95 D8.C
  Bottom 0.61: 26.67,7.94 CN4.3 RN1.6
F#_C
  Bottom 0.406: 21.59,7.94 21.59,4.76 23.5,2.86 75.88,2.86 81.92,8.89 81.92,17.14 84.45,19.68 84.45,24.45 85.09,25.08 85.09,29.84 88.9,33.66 IC1.15 | RN1.8 21.59,16.83 20.64,17.78 12.06,17.78 10.79,19.05 D6.C
  Bottom 0.61: RN1.8 CN4.1 21.59,7.94
F_B
  Bottom 0.406: IC1.12 83.82,25.72 83.5,25.4 83.5,20 80.96,17.46 80.96,9.21 75.56,3.81 25.72,3.81 24.13,5.4 24.13,7.94 | RN1.7 24.13,17.46 22.86,18.73 14.61,18.73 13.34,20 D7.C
  Bottom 0.61: RN1.7 CN4.2 24.13,7.94
GATE
  Bottom 0.406: LED1.A 87.63,26.04 87.63,26.67 IC1.14
GND
  Top 1.27: 64.77,83.19 JP4.1
  pour Top (isolate 0.254): 2.54,83.19 3.17,83.82 109.22,83.82 110.49,85.09 110.49,90.17 120.65,90.17 120.65,85.09 121.92,83.82 137.16,83.82 138.43,82.55 138.43,74.3 139.7,73.03 164.47,73.03 165.1,72.39 165.1,13.34 164.47,12.7 135.89,12.7 135.25,12.06 135.25,2.54 134.62,1.91 88.27,1.91 87.63,2.54 87.63,6.99 87,7.62 80.64,7.62 80.01,6.99 80.01,2.54 79.38,1.91 19.68,1.91 19.05,2.54 19.05,12.06 18.41,12.7 3.17,12.7 2.54,13.34
K11
  Bottom 0.406: IC6.1 51.12,16.19 63.18,16.19 67.94,11.43
  Bottom 0.61: CN5.6 68.58,10.79 67.94,11.43
K12
  Bottom 0.406: 65.41,11.43 61.59,15.24 48.9,15.24 47.94,16.19 47.94,19.05 48.58,19.68 51.44,19.68 52.07,19.05 IC6.2
  Bottom 0.61: CN5.5 66.04,10.79 65.41,11.43
K21
  Bottom 0.406: 62.87,11.43 60.01,14.29 48.26,14.29 46.99,15.56 46.99,19.37 48.26,20.64 53.34,20.64 54.61,19.37 IC6.3
  Bottom 0.61: CN5.4 63.5,10.79 62.87,11.43
K22
  Bottom 0.406: IC6.4 57.15,20.32 55.88,21.59 47.94,21.59 46.04,19.68 46.04,15.24 47.94,13.34 58.42,13.34 60.33,11.43
  Bottom 0.61: CN5.3 60.96,10.79 60.33,11.43
K31
  Bottom 0.406: 57.78,11.43 56.83,12.38 47.62,12.38 45.09,14.92 45.09,20 47.62,22.54 58.42,22.54 59.69,21.27 IC6.5
  Bottom 0.61: CN5.2 58.42,10.79 57.78,11.43
K32
  Bottom 0.406: 54.61,11.43 47.31,11.43 44.13,14.61 44.13,20.32 47.31,23.5 60.96,23.5 62.23,22.23 IC6.6
  Bottom 0.61: CN5.1 55.88,10.79 55.24,11.43 54.61,11.43
KO
  Bottom 0.61: R7.2 CN1.1
KV
  Bottom 0.61: 36.83,73.03 IC3.1 | 36.83,73.03 36.2,73.66 27.94,73.66 26.67,74.93 CN1.3 | IC3.2 39.37,73.03 38.73,73.66 37.47,73.66 36.83,73.03
LE
  Bottom 0.406: IC1.26 60.96,32.38 59.69,31.11 59.69,27.3 59.69,26.04 IC6.12
MISO
  Bottom 0.406: IC1.18 81.28,40.01
  Bottom 0.61: 81.28,40.01 JP5.6
MOSI
  Top 0.406: IC1.17 83.82,34.29 84.45,33.66 91.44,33.66 92.71,32.38 109.86,32.38 111.12,31.11 IC2.5
  Bottom 0.406: 83.19,43.18 82.55,42.55 82.55,38.73 83.82,37.47 IC1.17
  Bottom 0.61: 83.19,43.18 JP5.3
N15V
  pour Bottom: 110.49,90.17 102.87,90.17 102.87,81.28 105.41,81.28 105.41,82.55 107.95,85.09 110.49,85.09
N$1
  Bottom 0.406: D6.A SW1.7
N$2
  Bottom 0.61: R18.2 148.59,37.47 149.86,38.73 IC4.3
N$3
  Bottom 0.61: 41.91,80.01 42.55,80.64 45.72,80.64 46.35,80.01 R14.2 R15.2 | 41.91,80.01 IC3.6 | IC3.7 39.37,80.01 40.01,80.64 41.27,80.64 41.91,80.01
N$4
  Bottom 0.406: D7.A SW1.8
N$5
  Bottom 0.406: R2.1 93.98,48.26 92.08,50.16 74.93,50.16 73.03,52.07 OK1.1
N$6
  Bottom 0.406: D8.A SW1.9
N$7
  Bottom 0.406: R5.2 R2.2 92.08,24.77 LED1.K
N$8
  Bottom 0.406: LED2.A 74.93,13.97 76.2,15.24 R19.2
N$9
  Bottom 0.61: OC1.1 104.78,12.7 103.5,11.43 D3.C 103.5,7.62 104.14,6.99 113.67,6.99 114.3,7.62 R8.1
N$10
  Bottom 0.406: R5.1 96.52,38.73 95.25,40.01 95.25,48.9 92.71,51.44 84.45,51.44 83.19,52.7 OK2.1
N$11
  Bottom 0.61: Q3.2 103.5,60.96 102.87,60.33 99.69,60.33 99.06,60.96 R4.2 R13.2 93.34,62.23 91.44,64.14 C16.-
N$12
  Bottom 0.61: OK2.4 83.19,68.58 82.55,69.22 76.2,69.22 75.56,68.58 | 75.56,68.58 74.93,69.22 70.48,69.22 | 70.48,69.22 69.85,68.58 R1.2 | 75.56,68.58 OK1.3 | R7.1 31.75,62.23 33.02,60.96 45.72,60.96 46.99,62.23 46.99,72.39 48.9,74.3 68.58,74.3 69.85,73.03 69.85,69.85 70.48,69.22
N$13
  Bottom 0.813: Q3.1 106.68,63.5 106.05,64.14 102.23,64.14 101.6,63.5 R11.2
N$14  (via drill 0.9)
  other vias: 19.05,15.24
N$15
  Bottom 0.813: R10.1 158.12,34.29 162.56,38.73 JP3.2
N$16  (via drill 0.9)
  other vias: 16.51,15.24
N$17
  Bottom 0.406: D9.A SW1.10
N$18
  Bottom 0.406: D10.A SW1.11
N$19
  Bottom 0.61: D3.A 107.95,10.16 107.31,10.79 OC1.2 107.31,16.51 107.95,17.14 131.44,17.14 132.72,15.88 JP1.2
N$20
  Bottom 0.61: R8.2 JP1.1
N$21
  Bottom 0.61: R16.1 29.21,60.96 30.48,59.69 46.99,59.69 48.26,60.96 48.26,71.12 50.16,73.03 66.67,73.03 67.94,71.75 67.94,62.23 69.22,60.96 85.72,60.96 88.27,58.42 88.27,54.61 89.53,53.34 93.34,53.34 97.16,49.53 97.16,41.91 98.42,40.64 IC4.1 IC4.2
N$22
  Bottom 0.406: D11.A SW1.12
N$23
  Bottom 0.406: 90.17,12.06 90.17,13.97 88.9,15.24 R12.2
  Bottom 0.61: JP2.1 90.17,12.06
N$24
  Bottom 0.406: 92.71,12.06 92.71,13.97 88.9,17.78 87.63,17.78 R9.2
  Bottom 0.61: JP2.2 92.71,12.06
N$25  (via drill 0.9)
  other vias: 8.26,32.38
N$26  (via drill 0.9)
  other vias: 5.71,32.38
N$27  (via drill 0.9)
  other vias: 8.26,40.01
N$28  (via drill 0.9)
  other vias: 5.71,40.01
N$62
  Top 0.406: X1.2 73.79,18.02 C1.1
  Bottom 0.406: X1.2 74.93,21.59 76.2,22.86 IC1.9
N$63
  Top 0.406: X1.1 78.61,18.02 C2.1
  Bottom 0.406: X1.1 78.61,25.27 78.74,25.4 IC1.10
NOTE
  Top 0.61: IC2.10 C12.1
  Bottom 0.61: IC2.10 111.76,38.1 112.39,38.73 119.38,38.73 120.65,37.47 R18.1
OCTAVE
  Top 0.61: IC2.11 C11.1
  Bottom 0.61: IC2.14 100.97,36.83 101.6,37.47 107.95,37.47 108.58,36.83 IC2.11
P15V
  pour Bottom: 120.65,90.17 128.27,90.17 128.27,81.28 125.73,81.28 125.73,82.55 123.19,85.09 120.65,85.09
PB1
  Bottom 0.61: IC5.5 152.4,67.31 148.59,71.12 CN3.4
PB2
  Bottom 0.406: IC4.5 152.4,50.16 151.13,51.44 151.13,55.88 153.67,58.42 153.67,68.58 151.13,71.12 151.13,73.66
  Bottom 0.61: 151.13,73.66 CN3.3
PB3
  Bottom 0.406: IC5.3 149.86,51.44 151.13,50.16 151.13,46.35 151.76,45.72 154.31,45.72 154.94,46.35 154.94,69.22 153.67,70.48 153.67,73.66
  Bottom 0.61: 153.67,73.66 CN3.2
PB_VREF
  Top 0.61: IC2.13 C22.1
  Bottom 0.61: IC2.13 103.5,33.66 102.87,33.02 93.34,33.02 92.08,34.29 92.08,46.35 90.17,48.26 69.22,48.26 67.94,49.53 67.94,54.61 66.04,56.52 66.04,70.48 64.77,71.75 53.34,71.75 52.7,71.12 R14.1 55.24,67.31 | 55.24,67.31 D5.C | D4.A 52.7,64.77 55.24,67.31
PBI
  Bottom 0.61: CN3.1 156.21,78.11 154.94,79.38 139.06,79.38 137.79,78.11 IC3.5
PBV
  Top 0.406: 68.58,38.1 C26.1 | IC1.23 68.58,38.1 | 68.58,38.1 68.58,41.91 69.85,43.18 D1.A
  Bottom 0.406: D1.A 68.58,45.09 67.94,45.72 67.94,46.35 66.04,48.26 D2.C
  Bottom 0.61: D2.C 66.04,53.34 64.14,55.24 64.14,68.58 62.87,69.85 R15.1
PI
  Bottom 0.61: 41.27,67.94 41.91,67.31 C17.1 C29.1 | 41.27,67.94 34.92,67.94 34.29,68.58 34.29,70.48 33.02,71.75 25.4,71.75 24.13,73.03 CN1.4 | 41.27,67.94 41.91,68.58 IC3.3
PO
  Bottom 0.61: R16.2 CN1.2
RX
  Top 0.406: IC1.2 58.42,29.84 59.69,31.11 90.17,31.11 92.08,29.21 92.08,21.59 93.34,20.32 R6.2
  Bottom 0.406: OC1.4 109.86,24.13 109.22,24.77 102.87,24.77 102.23,24.13 102.23,21.59 100.97,20.32 R6.2
SCK
  Top 0.406: IC1.19 78.74,33.66 80.01,32.38 90.81,32.38 92.08,31.11 107.31,31.11 108.58,29.84 IC2.4
  Bottom 0.406: JP5.4 83.82,39.37 85.09,38.1 85.09,34.29 84.45,33.66 79.38,33.66 78.74,34.29 IC1.19
SCL
  Bottom 0.406: IC1.28 55.88,44.45 51.44,48.9 IC7.6 51.44,56.52 52.7,57.78 R87.1
SDA
  Top 0.406: IC1.27 58.42,37.47 57.15,38.73 57.15,45.72 53.98,48.9 IC7.5
  Bottom 0.406: IC7.5 R88.1
SO
  Bottom 0.406: R17.1 41.91,24.13 45.72,27.94 53.34,27.94 | IC1.24 66.04,36.83 65.41,37.47 60.33,37.47 59.69,36.83 59.69,34.29 53.34,27.94 | IC6.14 54.61,26.67 53.34,27.94
TX
  Top 0.406: IC1.3 60.96,29.21 61.59,29.84 89.53,29.84 90.81,28.57 90.81,19.05 92.08,17.78 R9.1

### Text on the board
tPlace: GND | PI | KV | PO | KO | -15 | -15 | -15 | GND | GND | GND | +15 | +15 | +15 | Yamaha SSK Equivalent Key Assigner | Portamento/CV/Gate | POWER | For Yamaha CS15 | Use only | 1V | 2V | 4V | PB1 | PB2 | PB3 | PBI | one opto | PITCHBEND | (Optional) | http://www.cs80.com/SSK | MOSI | oldcrow@oldcrows.net | GND | 5V | PP | ON=1 | PN | MIDI CH | 8 4 2 1 | KEY FOLLOW | MICROTONAL | C | MISO | SCK | S | !RES! | R | x6 | GATE | Product of Old Crow | K11 | Rev 1.1 | APR 2014 | K32 | K31 | K22 | K21 | K12 | 4 5 | 4 5